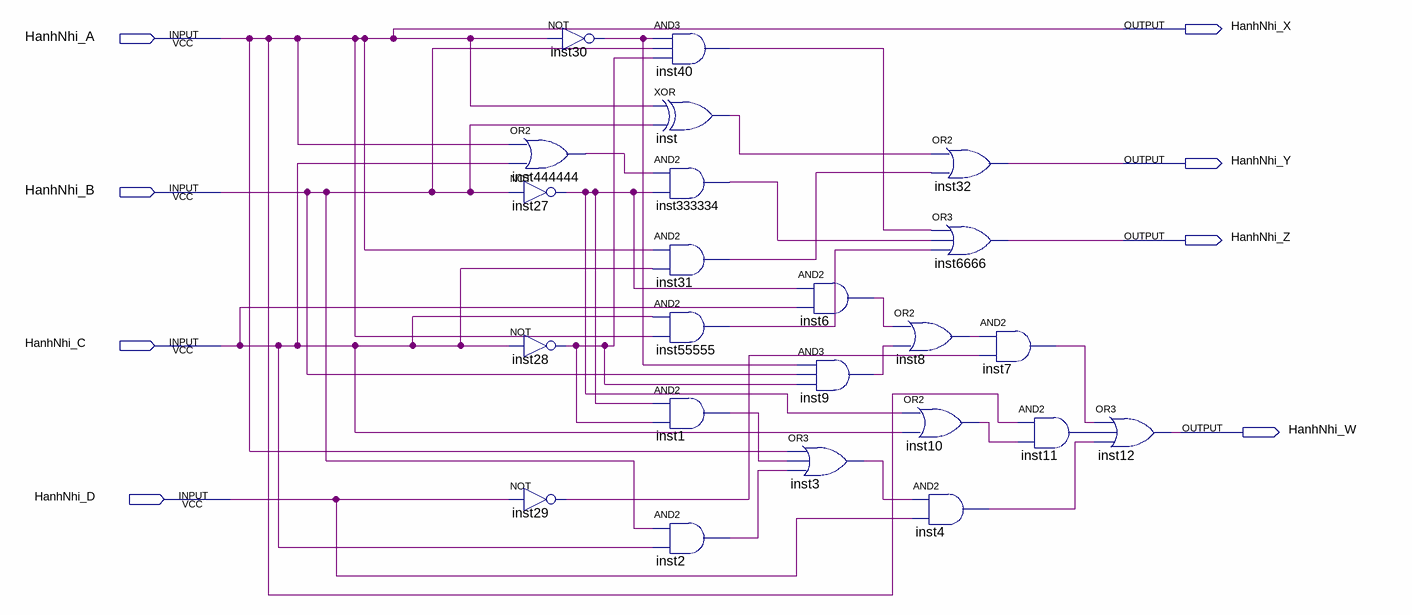
[diagram p0: schematic sheet]
// Quartus schematic Assignment3.bdf as structural Verilog: 23 symbols, 8 pins
module Assignment3 (
  input  HanhNhi_A,
  input  HanhNhi_B,
  input  HanhNhi_C,
  input  HanhNhi_D,
  output HanhNhi_X,
  output HanhNhi_Y,
  output HanhNhi_Z,
  output HanhNhi_W
);

  wire inst1_out, inst2_out, inst3_out, inst4_out, inst6_out, inst7_out, inst8_out, inst9_out, inst10_out,
       inst11_out, inst27_out, inst28_out, inst29_out, inst30_out, inst31_out, inst40_out, inst55555_out,
       inst333334_out, inst444444_out, inst_out;

  not inst30 (inst30_out, HanhNhi_A);
  or inst444444 (inst444444_out, HanhNhi_A, HanhNhi_C);
  not inst27 (inst27_out, HanhNhi_B);
  not inst28 (inst28_out, HanhNhi_C);
  not inst29 (inst29_out, HanhNhi_D);
  and inst40 (inst40_out, inst30_out, HanhNhi_B, inst28_out);
  xor inst (inst_out, HanhNhi_A, HanhNhi_B);
  and inst333334 (inst333334_out, inst444444_out, inst27_out);
  and inst31 (inst31_out, HanhNhi_A, HanhNhi_C);
  and inst55555 (inst55555_out, HanhNhi_C, HanhNhi_A);
  and inst1 (inst1_out, inst27_out, inst28_out);
  and inst2 (inst2_out, HanhNhi_B, HanhNhi_C);
  or inst3 (inst3_out, HanhNhi_A, inst1_out, inst2_out);
  and inst6 (inst6_out, inst27_out, HanhNhi_C);
  and inst9 (inst9_out, inst30_out, HanhNhi_B, inst28_out);
  or inst32 (HanhNhi_Y, inst_out, inst31_out);
  or inst6666 (HanhNhi_Z, inst40_out, inst333334_out, inst55555_out);
  or inst8 (inst8_out, inst6_out, inst9_out);
  or inst10 (inst10_out, inst27_out, HanhNhi_C);
  and inst4 (inst4_out, inst3_out, HanhNhi_D);
  and inst7 (inst7_out, inst8_out, inst29_out);
  and inst11 (inst11_out, HanhNhi_A, inst10_out);
  or inst12 (HanhNhi_W, inst7_out, inst11_out, inst4_out);

  assign HanhNhi_X = HanhNhi_A;
endmodule
